# Altium project CatLaserTorrent.PrjPcb
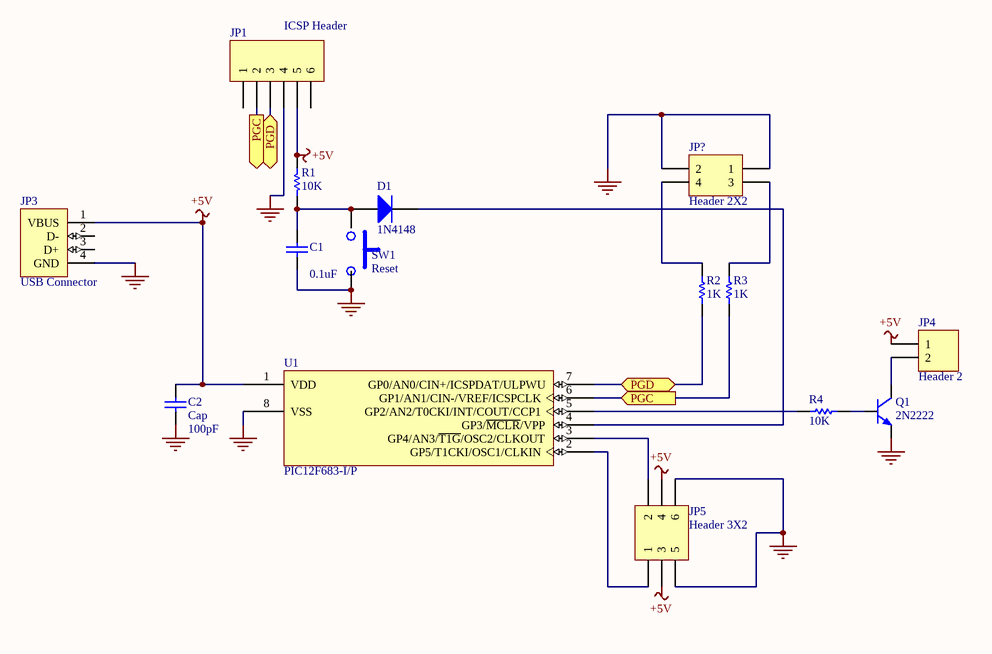
[diagram p0: MainBoard.SchDoc]
1 sheet, 15 parts. Net scope: flat (ports and power ports of the same name join across sheets).
Board file: CatTorretPCB.PcbDoc

## Sheet MainBoard.SchDoc
size A4; SheetNumber: 1; SheetTotal: 1

### Parts
C1  value 0.1uF  [CAP 0.1]  (hidden comment: Cap)
C2  Cap  value 100pF  [CAP 0.1]
D1  1N4148  [DIODE-0.2]
JP1  ICSP Header  [HDR1X6H]
JP3  USB Connector  [USB-B]
JP4  Header 2  [HDR1X2]
JP5  Header 3X2  [HDR2X3]
JP?  Header 2X2  [HDR2X2]
Q1  2N2222  [TO92 Wide legs Normal]
R1  value 10K  [AXIAL-0.3]  (hidden comment: Resistor)
R2  value 1K  [AXIAL-0.3]  (hidden comment: Res1)
R3  value 1K  [AXIAL-0.3]  (hidden comment: Res1)
R4  value 10K  [AXIAL-0.3]  (hidden comment: Res1)
SW1  Reset  [PUSHBUTTON 6x6mmx8.5mm]
U1  PIC12F683-I/P  [PDIP300-P8]

### Ports
PGC (in), PGC (out), PGD (bidir)

### Nets
+5V: C2.2 JP1.5 JP3.1(VBUS) JP4.1 JP5.3 JP5.4 R1.2 U1.1(VDD)
GND: C1.1 C2.1 JP1.4 JP3.4(GND) JP3.5(GND) JP3.6(GND) JP5.5 JP5.6 JP?.1 JP?.2 Q1.1(E) SW1.2 U1.8(VSS)
NetC1_2: C1.2 D1.1(A) R1.1 SW1.1
NetD1_2: D1.2(K) U1.4(GP3/~{MCLR}/VPP)
NetJP1_2: JP1.2 R3.1 U1.6(GP1/AN1/CIN-/VREF/ICSPCLK) ; port PGC
NetJP1_3: JP1.3 R2.1 U1.7(GP0/AN0/CIN+/ICSPDAT/ULPWU) ; port PGD
NetJP4_2: JP4.2 Q1.3(C)
NetJP5_1: JP5.1 U1.2(GP5/T1CKI/OSC1/CLKIN)
NetJP5_2: JP5.2 U1.3(GP4/AN3/~{T1G}/OSC2/CLKOUT)
NetJP?_3: JP?.3 R3.2
NetJP?_4: JP?.4 R2.2
NetQ1_2: Q1.2(B) R4.2
NetR4_1: R4.1 U1.5(GP2/AN2/T0CKI/INT/COUT/CCP1)

Not connected (* = marked no-connect by the designer): JP1 1 6; JP3 2(D-) 3(D+)

### Notes on the sheet
- Title
- Size:
- Date:
- A4
- Number:
- Time:
- Revision:
- Sheet
- of
- File:

### Library data of the parts
C1 C2 = Cap: Capacitor; Manufacturer: Generic Components; Class I: Passive; Published: 8-Jun-2000; Revision: July-2002: Re-released for DXP Platform.; Publisher: Altium Limited; Class II: Capacitor
D1 = Diode: Default Diode; Manufacturer: Generic Components; Class I: Discrete; Class II: Diode - Switching; Published: 8-Jun-2000; Revision: July-2002: Re-released for DXP Platform.; Publisher: Altium Limited
JP1 = Header 6H: Header, 6-Pin,  Right Angle; Manufacturer: Generic Components; Class I: Connector; Publisher: Altium Limited; Revision: July-2002: Re-released for DXP Platform.
JP4 = Header 2: Header, 2-Pin; Manufacturer: Generic Components; Class I: Connector; Revision: July-2002: Re-released for DXP Platform.; Publisher: Altium Limited
JP5 = Header 3X2: Header, 3-Pin, Dual row; Manufacturer: Generic Components; Class I: Connector; Revision: July-2002: Re-released for DXP Platform.; Publisher: Altium Limited
JP? = Header 2X2: Header, 2-Pin, Dual row; Manufacturer: Generic Components; Class I: Connector; Revision: July-2002: Re-released for DXP Platform.; Publisher: Altium Limited
Q1 = 2N2222: NPN General Purpose Amplifier; Manufacturer: Generic Components; Revision 1: 11-July-2000: SIM Model Added.; Revision 2: July-2002: Re-released for DXP Platform.; Class I: Discrete; Class II: BJT - Low Power; Published: 8-Jun-2000; Datasheet: Latest Revision: 1997; Package Reference: TO-92A; Publisher: Altium Limited
R1 = Res1: Manufacturer: Generic Components; Class I: Passive; Published: 8-Jun-2000; Revision: July-2002: Re-released for DXP Platform.; Publisher: Altium Limited; Class II: Resistor
R2-R4 = Res1: Resistor; Manufacturer: Generic Components; Class I: Passive; Published: 8-Jun-2000; Revision: July-2002: Re-released for DXP Platform.; Publisher: Altium Limited; Class II: Resistor
SW1 = PUSH BUTTON NO
U1 = PIC12F683-I/P: Flash-Based 8-Bit CMOS Microcontroller with nanoWatt Technology, 2K (x14-Bit words) Program Memory, 384 Bytes Data Memory, 8-Pin PDIP, Industrial Temperature; Published: 29-Jan-2009; LatestRevisionDate: 02-Dec-2009; LatestRevisionNote: Updated to datasheet revision revD, Feb-2007.; DatasheetVersion: revD, Feb-2007; PackageVersion: revBB, Aug-2009; PackageReference: PDIP300-P8; Publisher: Altium Limited; PackageDescription: 8-Lead Plastic Dual In-Line (P) - 300 mil Body [PDIP]; Supplier 1: Digi-Key; Supplier Part Number 1: PIC12F683-I/P-ND; Supplier 2: Farnell; Supplier Part Number 2: 9759034; Supplier 3: Farnell; Supplier Part Number 3: 1523923; Code_JEDEC: MS-001; ComponentLink1Description: Datasheet; ComponentLink1URL: http://ww1.microchip.com/downloads/en/DeviceDoc/41211D_.pdf; ComponentLink2Description: Packaging Specification; ComponentLink2URL: http://www.microchip.com/stellent/groups/techpub_sg/documents/packagingspec/en012702.pdf; ComponentLink3Description: Microchip.com Home; ComponentLink3URL: http://www.microchip.com/